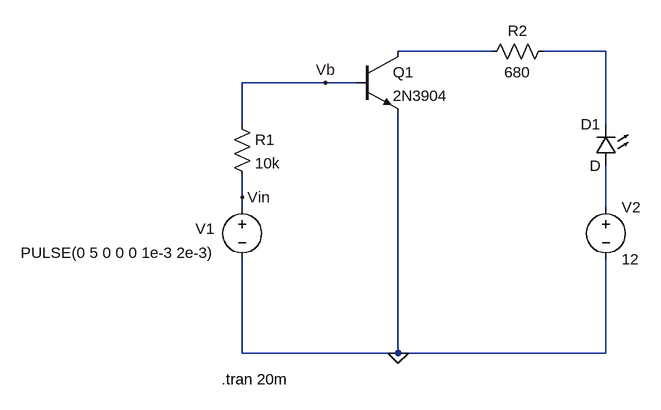
[diagram p0: schematic NPN_LED.asc]
NPN_LED.asc, the LTspice schematic file:
Version 4
SHEET 1 880 680
WIRE 320 -64 176 -64
WIRE 496 -64 400 -64
WIRE 64 -16 -64 -16
WIRE 112 -16 64 -16
WIRE -64 48 -64 -16
WIRE 496 48 496 -64
WIRE -64 160 -64 128
WIRE -64 176 -64 160
WIRE 496 176 496 112
WIRE -64 400 -64 256
WIRE 176 400 176 32
WIRE 176 400 -64 400
WIRE 496 400 496 256
WIRE 496 400 176 400
FLAG 176 400 0
FLAG 64 -16 Vb
FLAG -64 160 Vin
SYMBOL res -80 32 R0
SYMATTR InstName R1
SYMATTR Value 10k
SYMBOL voltage -64 160 R0
WINDOW 123 0 0 Left 0
WINDOW 39 0 0 Left 0
WINDOW 3 -341 86 Left 2
WINDOW 0 -72 49 Left 2
SYMATTR Value PULSE(0 5 0 0 0 1e-3 2e-3)
SYMATTR InstName V1
SYMBOL voltage 496 160 R0
WINDOW 123 0 0 Left 0
WINDOW 39 0 0 Left 0
SYMATTR InstName V2
SYMATTR Value 12
SYMBOL res 416 -80 R90
WINDOW 0 0 56 VBottom 2
WINDOW 3 32 56 VTop 2
SYMATTR InstName R2
SYMATTR Value 680
SYMBOL LED 512 112 R180
WINDOW 0 24 64 Left 2
WINDOW 3 24 0 Left 2
SYMATTR InstName D1
SYMBOL npn 112 -64 R0
SYMATTR InstName Q1
SYMATTR Value 2N3904
TEXT -96 440 Left 2 !.tran 20m

The netlist it stands for:
* NPN_LED.asc
R1 Vb Vin 10k
V1 Vin 0 PULSE(0 5 0 0 0 1e-3 2e-3)
V2 N003 0 12
R2 N002 N001 680
D1 N003 N002 D
Q1 N001 Vb 0 0 2N3904
.model D D
.lib standard.dio
.model NPN NPN
.model PNP PNP
.lib standard.bjt
.tran 20m
.backanno
.end